# Altium schematic sheet STM32F103RC.SchDoc
size A4
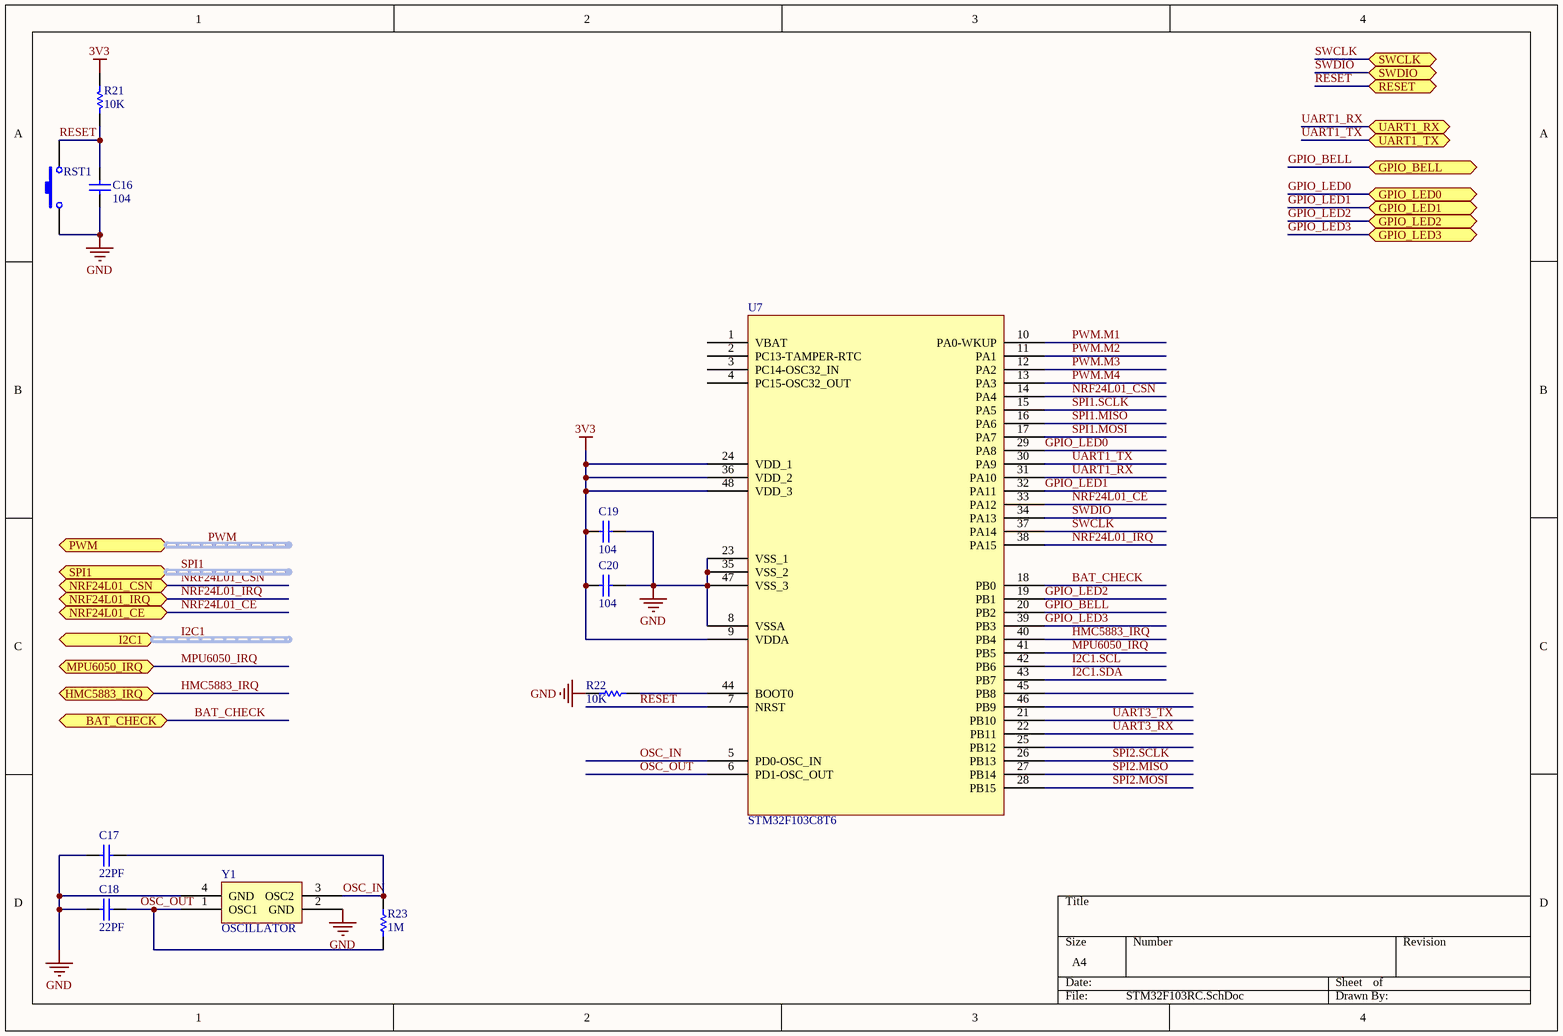
[diagram p0: STM32F103RC.SchDoc]

## Parts
C16  value 104  [CAP_0603]  (hidden comment: Cap)
C17  value 22PF  [CAP_0603]  (hidden comment: Cap)
C18  value 22PF  [CAP_0603]  (hidden comment: Cap)
C19  value 104  [CAP_0603]  (hidden comment: Cap)
C20  value 104  [CAP_0603]  (hidden comment: Cap)
R21  value 10K  [RES_0603]  (hidden comment: Res1)
R22  value 10K  [RES_0603]  (hidden comment: Res1)
R23  value 1M  [RES_0603]  (hidden comment: Res1)
RST1  SW-PB  [KEY]  (value not drawn)
U7  STM32F103C8T6  [TQFP_48]
Y1  OSCILLATOR  [3225]

## Ports
BAT_CHECK, GPIO_BELL, GPIO_LED0, GPIO_LED1, GPIO_LED2, GPIO_LED3, HMC5883_IRQ, I2C1 (harness I2C1), MPU6050_IRQ, NRF24L01_CE, NRF24L01_CSN, NRF24L01_IRQ, PWM (harness PWM), RESET, SPI1 (harness SPI1), SWCLK, SWDIO, UART1_RX, UART1_TX

## Nets
3V3: C19.1 C20.1 R21.2 U7.9(VDDA) U7.24(VDD_1) U7.36(VDD_2) U7.48(VDD_3)
GND: C16.2 C17.1 C18.1 C19.2 C20.2 R22.1 RST1.2 U7.8(VSSA) U7.23(VSS_1) U7.35(VSS_2) U7.47(VSS_3) Y1.2(GND) Y1.4(GND)
BAT_CHECK: U7.18(PB0) ; port BAT_CHECK
GPIO_BELL: U7.20(PB2) ; port GPIO_BELL
GPIO_LED0: U7.29(PA8) ; port GPIO_LED0
GPIO_LED1: U7.32(PA11) ; port GPIO_LED1
GPIO_LED2: U7.19(PB1) ; port GPIO_LED2
GPIO_LED3: U7.39(PB3) ; port GPIO_LED3
HMC5883_IRQ: U7.40(PB4) ; port HMC5883_IRQ
I2C1.SCL: U7.42(PB6)
I2C1.SDA: U7.43(PB7)
MPU6050_IRQ: U7.41(PB5) ; port MPU6050_IRQ
NRF24L01_CE: U7.33(PA12) ; port NRF24L01_CE
NRF24L01_CSN: U7.14(PA4) ; port NRF24L01_CSN
NRF24L01_IRQ: U7.38(PA15) ; port NRF24L01_IRQ
OSC_IN: C17.2 R23.2 U7.5(PD0-OSC_IN) Y1.3(OSC2)
OSC_OUT: C18.2 R23.1 U7.6(PD1-OSC_OUT) Y1.1(OSC1)
PWM.M1: U7.10(PA0-WKUP)
PWM.M2: U7.11(PA1)
PWM.M3: U7.12(PA2)
PWM.M4: U7.13(PA3)
RESET: C16.1 R21.1 RST1.1 U7.7(NRST) ; port RESET
SPI1.MISO: U7.16(PA6)
SPI1.MOSI: U7.17(PA7)
SPI1.SCLK: U7.15(PA5)
SPI2.MISO: U7.27(PB14)
SPI2.MOSI: U7.28(PB15)
SPI2.SCLK: U7.26(PB13)
SWCLK: U7.37(PA14) ; port SWCLK
SWDIO: U7.34(PA13) ; port SWDIO
UART1_RX: U7.31(PA10) ; port UART1_RX
UART1_TX: U7.30(PA9) ; port UART1_TX
UART3_RX: U7.22(PB11)
UART3_TX: U7.21(PB10)
NetR22_2: R22.2 U7.44(BOOT0)

Not connected (* = marked no-connect by the designer): U7 1(VBAT) 2(PC13-TAMPER-RTC) 3(PC14-OSC32_IN) 4(PC15-OSC32_OUT) 25(PB12) 45(PB8) 46(PB9)

## Buses and harness runs
harness I2C1 = port I2C1
harness PWM = port PWM
harness SPI1 = port SPI1

## Library data of the parts
C16-C20 = Cap: Capacitor; Published: 8-Jun-2000; LatestRevisionDate: 17-Jul-2002; LatestRevisionNote: Re-released for DXP Platform.; PackageReference: RAD-0.3; Publisher: Altium Limited; PackageDescription: Radial Cap, Thru-Hole; 2 Leads; 0.3 in Pin Spacing
R21-R23 = Res1: Resistor; Published: 8-Jun-2000; LatestRevisionDate: 17-Jul-2002; LatestRevisionNote: Re-released for DXP Platform.; PackageReference: AXIAL-0.3; Publisher: Altium Limited; PackageDescription: Axial Device, Thru-Hole; 2 Leads; 0.3 in Pin Spacing
RST1 = SW-PB: Switch; Published: 24-Mar-1999; LatestRevisionDate: 17-Jul-2002; LatestRevisionNote: Re-released for DXP Platform.; PackageReference: SPST-2; Publisher: Altium Limited; PackageDescription: Switch; 2 Leads